# Altium project Amply.PrjPcb
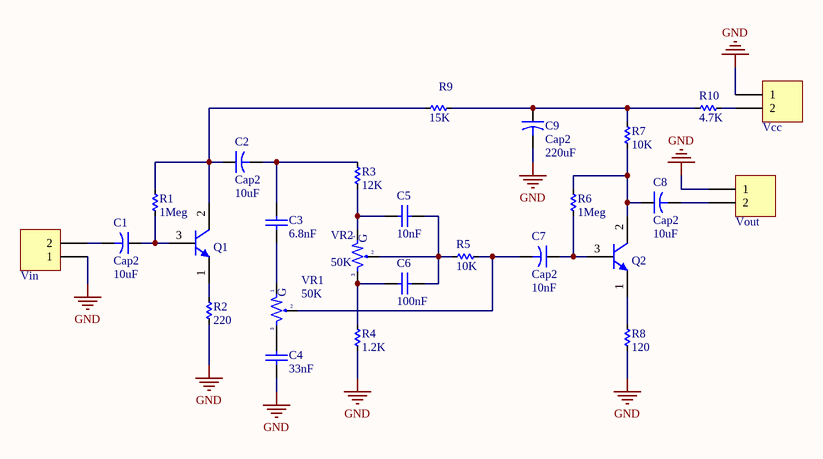
[diagram p0: Sche_1.SchDoc]
2 sheets, 62 parts. Net scope: global (net labels, ports and power ports of the same name join across sheets).
Board files: PCB_1.PcbDoc, PCB_2.PcbDoc, PCB_3.PcbDoc
Sheets:
  Sche_1.SchDoc
  Sche_2.SchDoc

## Sheet Sche_1.SchDoc
size A

### Parts
(Parts that share a designator on the sheet are numbered #1, #2 ... from top to bottom, then left to right.)
C1#1  Cap2  value 10uF  [CAPR5-4X5]
C2#1  Cap2  value 10uF  [CAPR5-4X5]
C3#1  value 6.8nF  [CN1.5]  (hidden comment: Cap Non-Pol)
C4#1  value 33nF  [CN1.5]  (hidden comment: Cap Non-Pol)
C5#1  value 10nF  [CN1.5]  (hidden comment: Cap Non-Pol)
C6#1  value 100nF  [CN1.5]  (hidden comment: Cap Non-Pol)
C7#1  Cap2  value 10nF  [CAPR5-4X5]
C8#1  Cap2  value 10uF  [CAPR5-4X5]
C9#1  Cap2  value 220uF  [CAPR5-4X5]
Q1#1  C1815  [QTO-92]  (value not drawn)
Q2#1  C1815  [QTO-92]  (value not drawn)
R1#1  1Meg  [RES-1/4W]
R2#1  220  [RES-1/4W]
R3#1  12K  [RES-1/4W]
R4#1  1.2K  [RES-1/4W]
R5#1  10K  [RES-1/4W]
R6#1  1Meg  [RES-1/4W]
R7#1  10K  [RES-1/4W]
R8#1  120  [RES-1/4W]
R9#1  15K  [RES-1/4W]
R10#1  4.7K  [RES-1/4W]
Vcc#1  Domino 2  [DOMINO 2- 5mm]  (value not drawn)
Vin#1  Domino 2  [DOMINO 2- 5mm]  (value not drawn)
Vout#1  Domino 2  [DOMINO 2- 5mm]  (value not drawn)
VR1#1  50K  [VR-S1]
VR2#1  50K  [VR-S1]

### Nets
GND: C4#1.1 C9#1.2 R2#1.2 R4#1.2 R8#1.2 Vcc#1.1 Vin#1.1 Vout#1.1
NetC1#1_1: C1#1.1 Q1#1.3(B) R1#1.2
NetC1#1_2: C1#1.2 Vin#1.2
NetC2#1_1: C2#1.1 Q1#1.2(C) R1#1.1 R9#1.2
NetC2#1_2: C2#1.2 C3#1.2 R3#1.1
NetC3#1_1: C3#1.1 VR1#1.1
NetC4#1_2: C4#1.2 VR1#1.3
NetC5#1_1: C5#1.1 R3#1.2 VR2#1.1
NetC5#1_2: C5#1.2 C6#1.2 R5#1.2 VR2#1.2
NetC6#1_1: C6#1.1 R4#1.1 VR2#1.3
NetC7#1_1: C7#1.1 Q2#1.3(B) R6#1.2
NetC7#1_2: C7#1.2 R5#1.1 VR1#1.2
NetC8#1_1: C8#1.1 Q2#1.2(C) R6#1.1 R7#1.2
NetC8#1_2: C8#1.2 Vout#1.2
NetC9#1_1: C9#1.1 R7#1.1 R9#1.1 R10#1.2
NetQ1#1_1: Q1#1.1(E) R2#1.1
NetQ2#1_1: Q2#1.1(E) R8#1.1
NetR10#1_1: R10#1.1 Vcc#1.2

### Notes on the sheet
- (in symbol VR-S) G

### Library data of the parts
C1#1 C2#1 C7#1 C8#1 C9#1 = Cap2: Capacitor; Published: 23-Sep-2002; PackageReference: CAPR5-4X5; Publisher: Altium Limited; PackageDescription: Capacitor; 2 Leads
C3#1 C4#1 C5#1 C6#1 = Cap Non-Pol: Capacitor
Q1#1 Q2#1 = C1815: NPN Bipolar Transistor
R1#1 R2#1 R3#1 R4#1 R5#1 R6#1 R7#1 R8#1 R9#1 R10#1 = Res: Manufacturer: Generic Components; Class: Passive; SubClass: R; Published: 08/06/2000; Publisher: Altium Hobart Technology Centre
Vcc#1 Vin#1 Vout#1 = Domino 2: Domino, 2-Pin; LatestRevisionDate: 17-Jul-2002; LatestRevisionNote: Re-released for DXP Platform.; Publisher: Altium Limited
VR1#1 VR2#1 = VR-S: Var Resistor; Value: Volume 50k

## Sheet Sche_2.SchDoc
size A
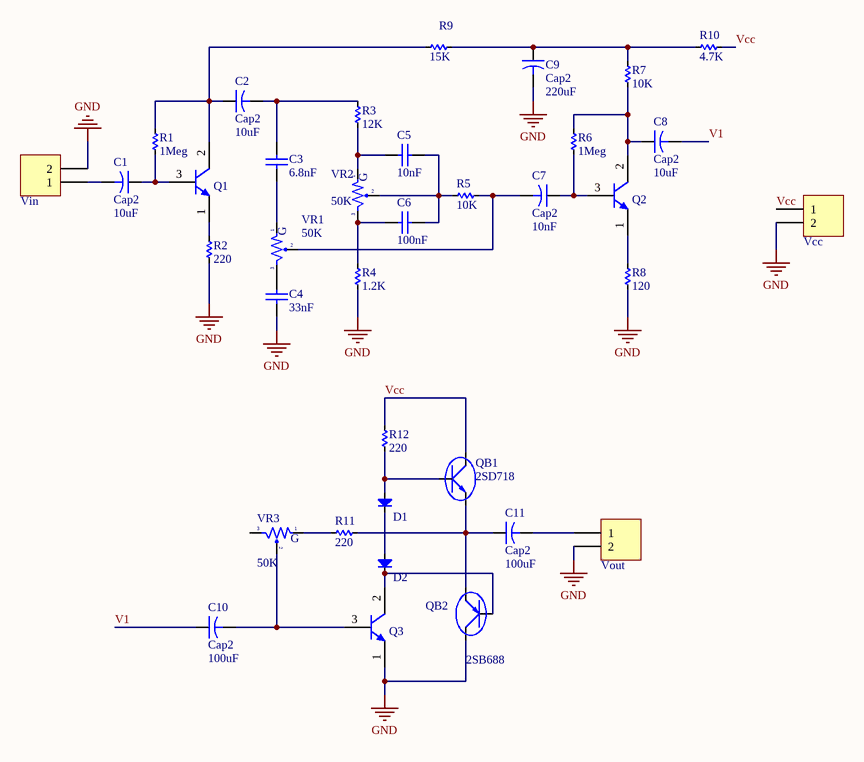
[diagram p1: Sche_2.SchDoc]

### Parts
(Parts that share a designator on the sheet are numbered #1, #2 ... from top to bottom, then left to right.)
C1#2  Cap2  value 10uF  [CAPR5-4X5]
C2#2  Cap2  value 10uF  [CAPR5-4X5]
C3#2  value 6.8nF  [CN1.5]  (hidden comment: Cap Non-Pol)
C4#2  value 33nF  [CN1.5]  (hidden comment: Cap Non-Pol)
C5#2  value 10nF  [CN1.5]  (hidden comment: Cap Non-Pol)
C6#2  value 100nF  [CN1.5]  (hidden comment: Cap Non-Pol)
C7#2  Cap2  value 10nF  [CAPR5-4X5]
C8#2  Cap2  value 10uF  [CAPR5-4X5]
C9#2  Cap2  value 220uF  [CAPR5-4X5]
C10  Cap2  value 100uF  [CAPR5-4X5]
C11  Cap2  value 100uF  [CAPR5-4X5]
D1  Diode  [DIO-1A]  (value not drawn)
D2  Diode  [DIO-1A]  (value not drawn)
Q1#2  C1815  [QTO-92]  (value not drawn)
Q2#2  C1815  [QTO-92]  (value not drawn)
Q3  C1815  [QTO-92]  (value not drawn)
QB1  2SD718  [TO247h]
QB2  2SB688  [TO247h]
R1#2  1Meg  [RES-1/4W]
R2#2  220  [RES-1/4W]
R3#2  12K  [RES-1/4W]
R4#2  1.2K  [RES-1/4W]
R5#2  10K  [RES-1/4W]
R6#2  1Meg  [RES-1/4W]
R7#2  10K  [RES-1/4W]
R8#2  120  [RES-1/4W]
R9#2  15K  [RES-1/4W]
R10#2  4.7K  [RES-1/4W]
R11  220  [RES-1/4W]
R12  220  [RES-1/4W]
Vcc#2  Domino 2  [DOMINO 2- 5mm]  (value not drawn)
Vin#2  Domino 2  [DOMINO 2- 5mm]  (value not drawn)
Vout#2  Domino 2  [DOMINO 2- 5mm]  (value not drawn)
VR1#2  50K  [VR-S1]
VR2#2  50K  [VR-S1]
VR3  50K  [VR-S1]

### Nets
GND: C4#2.1 C9#2.2 Q3.1(E) QB2.2(C) R2#2.2 R4#2.2 R8#2.2 Vcc#2.2 Vin#2.2 Vout#2.2
V1: C8#2.2 C10.1
Vcc: QB1.2(C) R10#2.1 R12.1 Vcc#2.1
NetC1#2_1: C1#2.1 Q1#2.3(B) R1#2.2
NetC1#2_2: C1#2.2 Vin#2.1
NetC2#2_1: C2#2.1 Q1#2.2(C) R1#2.1 R9#2.2
NetC2#2_2: C2#2.2 C3#2.2 R3#2.1
NetC3#2_1: C3#2.1 VR1#2.1
NetC4#2_2: C4#2.2 VR1#2.3
NetC5#2_1: C5#2.1 R3#2.2 VR2#2.1
NetC5#2_2: C5#2.2 C6#2.2 R5#2.2 VR2#2.2
NetC6#2_1: C6#2.1 R4#2.1 VR2#2.3
NetC7#2_1: C7#2.1 Q2#2.3(B) R6#2.2
NetC7#2_2: C7#2.2 R5#2.1 VR1#2.2
NetC8#2_1: C8#2.1 Q2#2.2(C) R6#2.1 R7#2.2
NetC9#2_1: C9#2.1 R7#2.1 R9#2.1 R10#2.2
NetC10_2: C10.2 Q3.3(B) VR3.2
NetC11_1: C11.1 QB1.3(E) QB2.3(E) R11.2
NetC11_2: C11.2 Vout#2.1
NetD1_1: D1.1(A) QB1.1(B) R12.2
NetD1_2: D1.2(K) D2.1(A)
NetD2_2: D2.2(K) Q3.2(C) QB2.1(B)
NetQ1#2_1: Q1#2.1(E) R2#2.1
NetQ2#2_1: Q2#2.1(E) R8#2.1
NetR11_1: R11.1 VR3.1

Not connected (* = marked no-connect by the designer): VR3 3

### Notes on the sheet
- (in symbol VR-S) G

### Library data of the parts
C1#2 C2#2 C7#2 C8#2 C9#2 C10 C11 = Cap2: Capacitor; Published: 23-Sep-2002; PackageReference: CAPR5-4X5; Publisher: Altium Limited; PackageDescription: Capacitor; 2 Leads
C3#2 C4#2 C5#2 C6#2 = Cap Non-Pol: Capacitor
D1 D2 = Diode: Default Diode; Code - JEDEC: DO-214-AB; Value: 1N5007; Published: 8-Jun-2000; Revision: July-2002: Re-released for DXP Platform.; Publisher: Altium Limited
Q1#2 Q2#2 Q3 = C1815: NPN Bipolar Transistor
QB1 = 2SC5200: Transistor Power Supply; Value: D718
QB2 = 2SB688: Transistor Power Supply; Value: B688
R1#2 R2#2 R3#2 R4#2 R5#2 R6#2 R7#2 R8#2 R9#2 R10#2 R11 R12 = Res: as R1#1 on sheet Sche_1; Published: 08/06/2000; Publisher: Altium Hobart Technology Centre
Vcc#2 Vin#2 Vout#2 = Domino 2: Domino, 2-Pin; LatestRevisionDate: 17-Jul-2002; LatestRevisionNote: Re-released for DXP Platform.; Publisher: Altium Limited
VR1#2 VR2#2 VR3 = VR-S: Var Resistor; Value: Volume 50k

## Nets that join several sheets
GND: Sche_1 (8 pins), Sche_2 (10 pins)